# Altium project SB0040B.PrjPCB
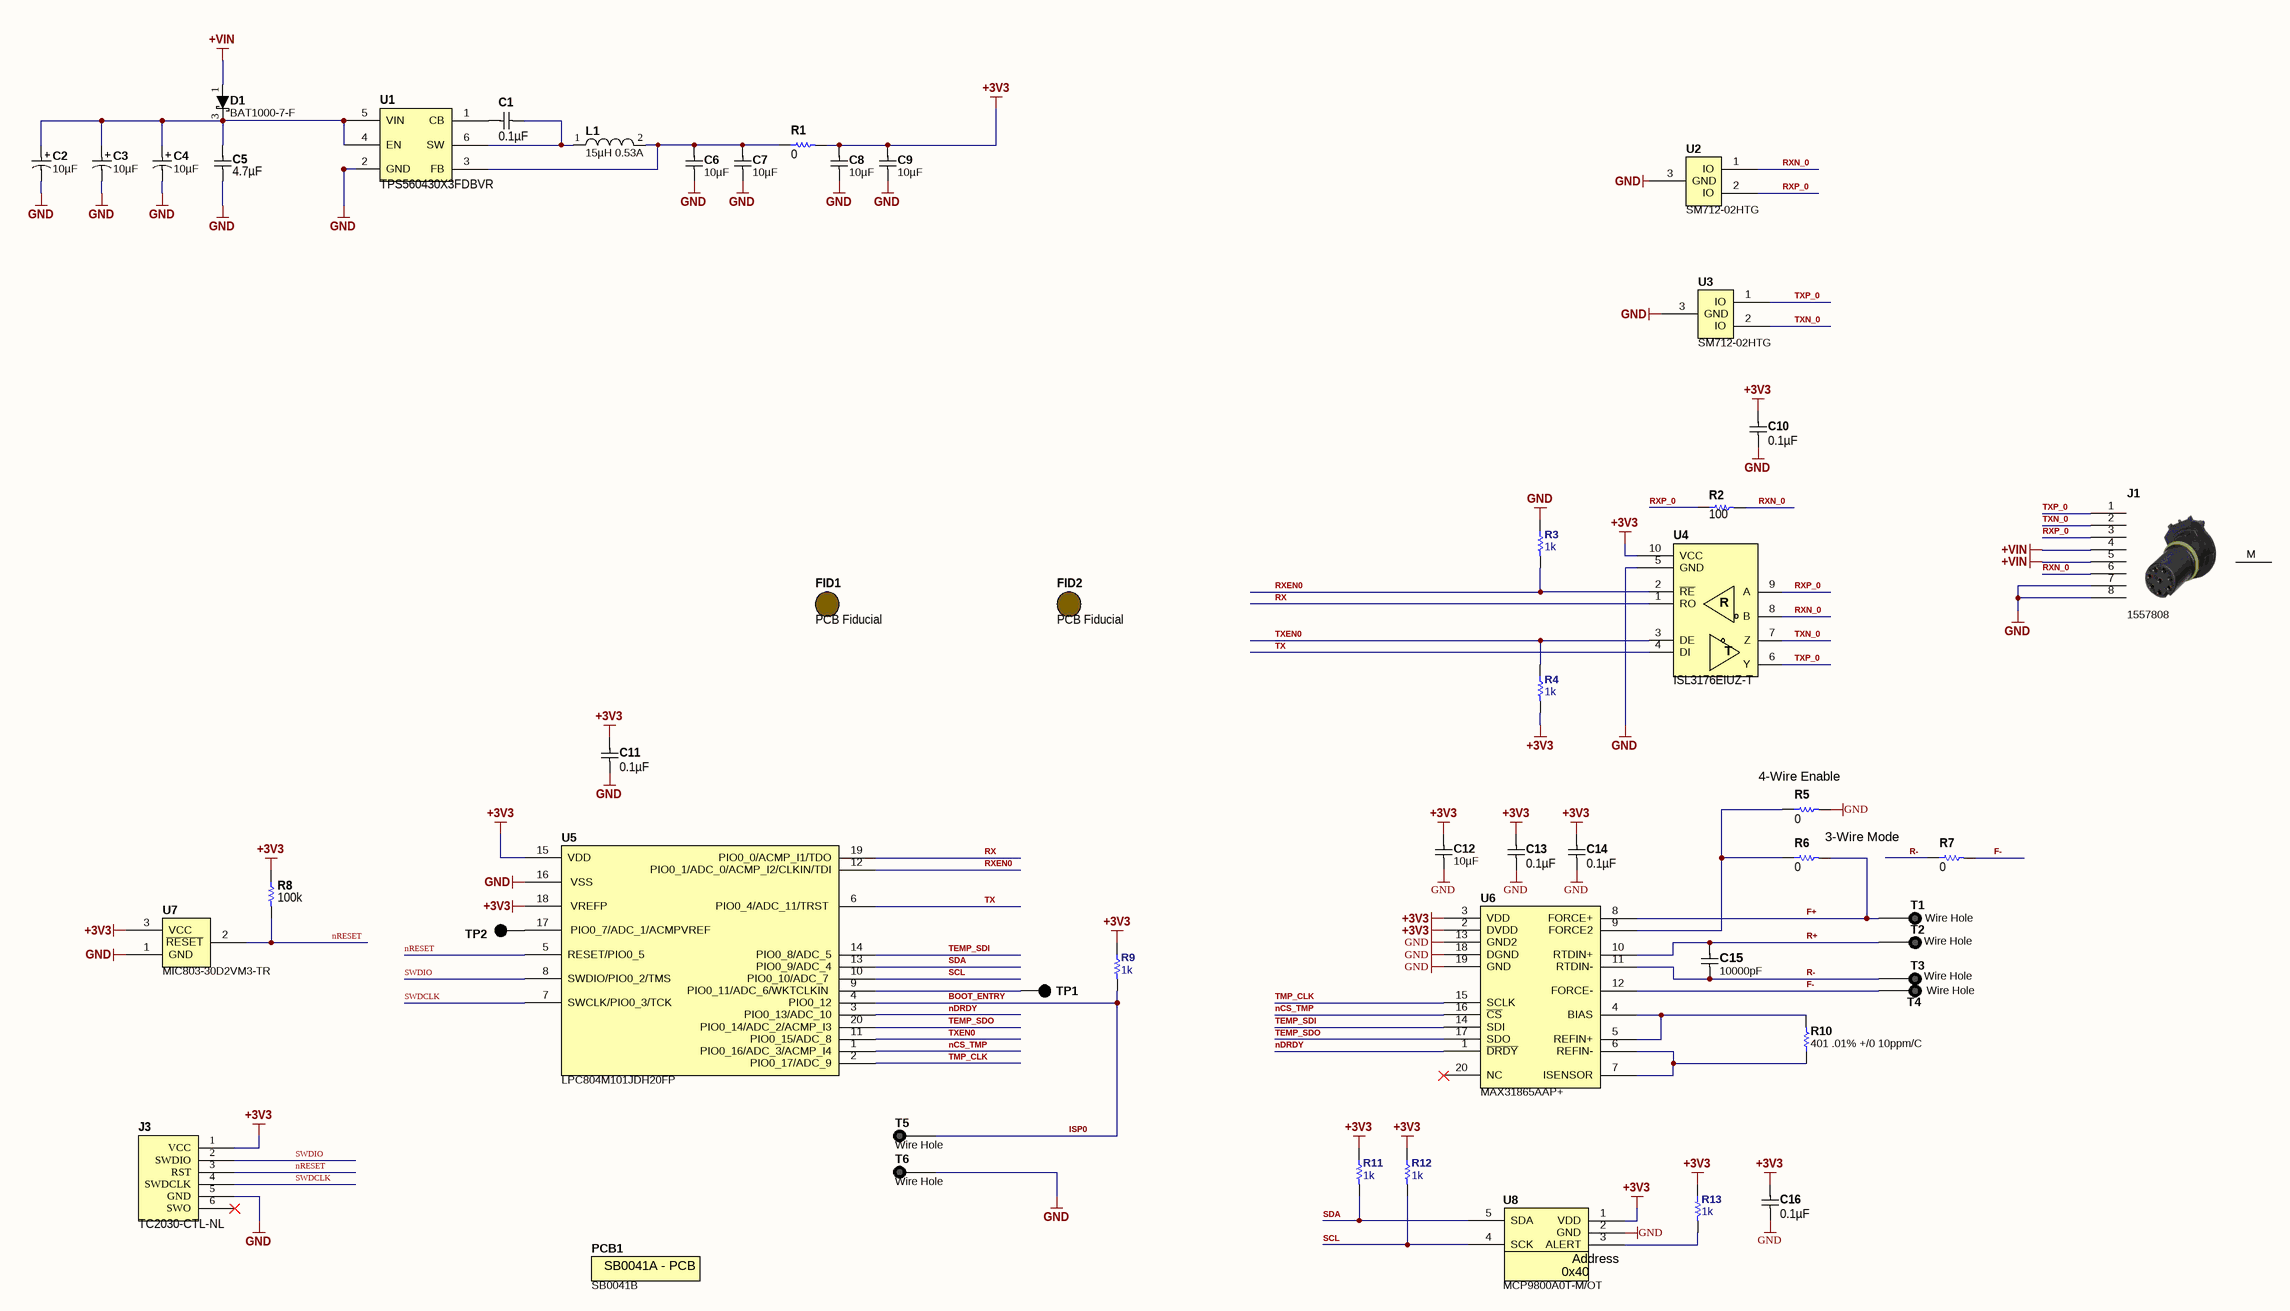
[diagram p0: TOP_LEVEL.SCHDOC]
BOM_NOTES_LINE_1: -; BOM_NOTES_LINE_2: -; BOM_NOTES_LINE_3: -; BOM_NOTES_LINE_4: -; CCA_PART_NUMBER: SB0040; CCA_TITLE: RTD to M12; PCB_COPPER_WEIGHT_INNER: N/A; PCB_COPPER_WEIGHT_OUTER: 1oz; PCB_FINISH_PLATING: GOLD ENIG; PCB_FINISHED_THICKNESS: .0625"; PCB_LAYERS: 4; PCB_MATERIAL: FR4; PCB_MIN_DRILL: 10; PCB_MIN_TRACE_SPACE: 6; PCB_MIN_TRACE_WIDTH: 6; PCB_PART_NUMBER: SB0041; PCB_PRINTOUT_SCALE: 1:1; PCB_SILKSCREEN_COLOR_BOTTOM: WHITE; PCB_SILKSCREEN_COLOR_TOP: WHITE; PCB_SOLDER_MASK_COLOR_BOTTOM: BLACK; PCB_SOLDER_MASK_COLOR_TOP: BLACK; PCB_TITLE: RTD to M12; PCB_VERSION: B; PROJECT_ENGINEER: E. Hughes; PROJECT_SHORT_TITLE: NRF_1CH_CELL; PROJECT_STATUS: PROTOTYPE; PROJECT_TITLE_LINE_1: RTD to M12; SCH_DATE: 2020-08-27
1 sheet, 52 parts. Net scope: hierarchical (ports join the sheet entries above them; power ports are global).
Board file: SB0041B.PCBDOC

## Sheet TOP_LEVEL.SCHDOC: FTDI 4-CH
size D; DocumentNumber: 1; SheetNumber: 4; SheetTotal: 4; PageSetup: Record=PageOptions|CenterHorizontal=True|CenterVertical=True|PrintScale=0.98|XCorrection=1.00|YCorrection=1.00|PrintKind=0|BorderSize=5000000|LeftOffset=0|BottomOffset=0|Orientation=2|PaperLength=1000|PaperWidth=1000|Scale=100|PaperSource=7|PrintQuality=600|MediaType=1|DitherType=10|PaperKind=Letter|PrintScaleMode=1; PAGE_TITLE: TOP LEVEL

### Parts
C1  0.1µF  [C0603_0.90MM_MD]
C2  10µF  [C_ALU_B]
C3  10µF  [C_ALU_B]
C4  10µF  [C_ALU_B]
C5  4.7µF  [C0805_1.50MM_MD]
C6  10µF  [C0805_1.25MM_MD]
C7  10µF  [C0805_1.25MM_MD]
C8  10µF  [C0805_1.25MM_MD]
C9  10µF  [C0805_1.25MM_MD]
C10  0.1µF  [C0603_0.90MM_MD]
C11  0.1µF  [C0603_0.90MM_MD]
C12  10µF  [C0805_1.25MM_MD]
C13  0.1µF  [C0603_0.90MM_MD]
C14  0.1µF  [C0603_0.90MM_MD]
C15  10000pF  [C0603_0.90MM_HD]
C16  0.1µF  [C0603_0.90MM_MD]
D1  BAT1000-7-F  [D_SOT-23-3_P]
FID1  PCB Fiducial  [Fiducial 1mm - 2mm]  (no BOM)
FID2  PCB Fiducial  [Fiducial 1mm - 2mm]  (no BOM)
J1  1557808  [1557808]
J3  TC2030‐CTL‐NL  [TC2030]  (no BOM)
L1  15µH 0.53A  [L_NRH3012]
PCB1  SB0041B  (mechanical)
R1  0  [R0603_0.55MM_MD]
R2  100  [R0603_0.55MM_MD]
R3  1k  [R0603_0.55MM_MD]
R4  1k  [R0603_0.55MM_MD]
R5  0  [R0603_0.55MM_MD]
R6  0  [R0603_0.55MM_MD]
R7  0  [R0603_0.55MM_MD]
R8  100k  [R0603_0.55MM_MD]
R9  1k  [R0603_0.55MM_MD]
R10  401 .01% +/0 10ppm/C  [R0603_0.55MM_MD]
R11  1k  [R0603_0.55MM_MD]
R12  1k  [R0603_0.55MM_MD]
R13  1k  [R0603_0.55MM_MD]
T1  Wire Hole  [SOLDER_HOLE]  (no BOM)
T2  Wire Hole  [SOLDER_HOLE]  (no BOM)
T3  Wire Hole  [SOLDER_HOLE]  (no BOM)
T4  Wire Hole  [SOLDER_HOLE]  (no BOM)
T5  Wire Hole  [SOLDER_HOLE]  (no BOM)
T6  Wire Hole  [SOLDER_HOLE]  (no BOM)
TP1  SMT_TEST  [SMT_TP - 35]  (value not drawn)  (no BOM)
TP2  SMT_TEST  [SMT_TP - 35]  (value not drawn)  (no BOM)
U1  TPS560430X3FDBVR  [SOT95P245X145-6L]
U2  SM712-02HTG  [SOT-23]
U3  SM712-02HTG  [SOT-23]
U4  ISL3176EIUZ-T  [10 MSOP]
U5  LPC804M101JDH20FP  [TSOP65P640X105-20N]
U6  MAX31865AAP+  [SOP65P780X200-20N]
U7  MIC803-30D2VM3-TR  [SOT-23]
U8  MCP9800A0T-M/OT  [SOT23-5]

### Nets
+3V3: C8.2 C9.2 C10.2 C11.2 C12.2 C13.2 C14.2 C16.2 J3.1(VCC) R1.2 R4.2 R8.1 R9.1 R11.1 R12.1 R13.1 U4.10(VCC) U5.15(VDD) U5.18(VREFP) U6.2(DVDD) U6.3(VDD) U7.3(VCC) U8.1(VDD)
+VIN: D1.1(A) J1.4 J1.5
GND: C2.2 C3.2 C4.2 C5.1 C6.1 C7.1 C8.1 C9.1 C10.1 C11.1 C12.1 C13.1 C14.1 C16.1 J1.7 J1.8 J3.5(GND) R3.1 R5.2 T6.1 U1.2(GND) U3.3(GND) U4.5(GND) U5.16(VSS) U6.13(GND2) U6.18(DGND) U6.19(GND) U7.1(GND) U8.2(GND)
BOOT_ENTRY: R9.2 T5.1 U5.4(PIO0_12)  [also labelled ISP0]
F+: R6.2 T1.1 U6.8(FORCE+)
F-: R7.2 T4.1 U6.12(FORCE-)
nCS_TMP: U5.1(PIO0_16/ADC_3/ACMP_I4) U6.16(~{CS})
nDRDY: U5.3(PIO0_13/ADC_10) U6.1(~{DRDY})
nRESET: J3.3(RST) R8.2 U5.5(RESET/PIO0_5) U7.2(~{RESET})
R+: C15.2 T2.1 U6.10(RTDIN+)
R-: C15.1 R7.1 T3.1 U6.11(RTDIN-)
RX: U4.1(RO) U5.19(PIO0_0/ACMP_I1/TDO)
RXEN0: R3.2 U4.2(~{RE}) U5.12(PIO0_1/ADC_0/ACMP_I2/CLKIN/TDI)
RXN_0: J1.6 R2.2 U2.1(IO) U4.8(B)
RXP_0: J1.3 R2.1 U2.2(IO) U4.9(A)
SCL: R12.2 U5.10(PIO0_10/ADC_7) U8.4(SCK)
SDA: R11.2 U5.13(PIO0_9/ADC_4) U8.5(SDA)
SWDCLK: J3.4(SWDCLK) U5.7(SWCLK/PIO0_3/TCK)
SWDIO: J3.2(SWDIO) U5.8(SWDIO/PIO0_2/TMS)
TEMP_SDI: U5.14(PIO0_8/ADC_5) U6.14(SDI)
TEMP_SDO: U5.20(PIO0_14/ADC_2/ACMP_I3) U6.17(SDO)
TMP_CLK: U5.2(PIO0_17/ADC_9) U6.15(SCLK)
TX: U4.4(DI) U5.6(PIO0_4/ADC_11/TRST)
TXEN0: R4.1 U4.3(DE) U5.11(PIO0_15/ADC_8)
TXN_0: J1.2 U3.2(IO) U4.7(Z)
TXP_0: J1.1 U3.1(IO) U4.6(Y)
NetC1_1: C1.1 L1.1 U1.6(SW)
NetC1_2: C1.2 U1.1(CB)
NetC2_1: C2.1 C3.1 C4.1 C5.2 D1.3(K) U1.4(EN) U1.5(VIN)
NetC6_2: C6.2 C7.2 L1.2 R1.1 U1.3(FB)
NetR5_1: R5.1 R6.1 U6.9(FORCE2)
NetR10_1: R10.1 U6.6(REFIN-) U6.7(ISENSOR)
NetR10_2: R10.2 U6.4(BIAS) U6.5(REFIN+)
NetR13_2: R13.2 U8.3(ALERT)
NetTP1_1: TP1.1 U5.9(PIO0_11/ADC_6/WKTCLKIN)
NetTP2_1: TP2.1 U5.17(PIO0_7/ADC_1/ACMPVREF)

Not connected (* = marked no-connect by the designer): J1 M; J3 6(SWO)*; U2 3(GND); U6 20(NC)*

### Notes on the sheet
- (near R5) 4-Wire Enable
- 3-Wire Mode
- Labels drawn without touching a wire or pin: GND
- PCB REV
- CCA REV
- Sheet
- of
- (in symbol ISL3176EIUZ-T) R; T
- (in symbol MCP9800A0T-M/OT) Address; 0x40
- (in symbol SB0041B) SB0041A - PCB

### Library data of the parts
C1 C10 C11 C13 C14 C16 = CGA3E2X7R1H104K080AE: CAP CER 0.1UF 50V X7R 0603; Manufacturer: TDK Corporation; Tolerance: ±10%; Substitution Notes: 0.1µF , 50V , ±10% , X7R , -55°C ~ 125°C , AEC-Q200 , 0603; Value: 0.1µF; Temperature Coefficient: X7R; Manufacturer Part Number: CGA3E2X7R1H104K080AE; ComponentLink1Description: Datasheet (Internal); ComponentLink1URL: datasheets\TDK\mlcc_automotive_general_en.pdf; ComponentLink2Description: Datasheet (External); ComponentLink2URL: https://product.tdk.com/info/en/catalog/datasheets/mlcc_automotive_general_en.pdf; Supplier 1: Digikey; Supplier Part Number 1: 445-15957-1-ND; Category: Capacitors; Voltage - Rated: 50V; Features: Soft Termination; Operating Temperature: -55°C ~ 125°C; Ratings: AEC-Q200; Package: 0603; Thickness (Max): 0.90MM
C2-C4 = EEE-FK1V100UR: CAP ALUM 10UF 35V 20% SMD; Manufacturer: Panasonic Electronic Components; Lifetime @ Temp#: 2000 Hrs @ 105°C; Ripple Current: 90mA; Impedance: 1.35 Ohm; Surface Mount Land Size: 0.169" L x 0.169" W (4.30mm x 4.30mm); Value_Voltage: 10µF  35V; Value: 10µF; Temperature Coefficient: Temperature Coefficient; Manufacturer Part Number: EEE-FK1V100UR; ComponentLink1Description: Internal Datasheet; ComponentLink1URL: http://industrial.panasonic.com/www-cgi/jvcr13pz.cgi?E+PZ+3+ABA0120+EEEFK1V100UR+7+WW; ComponentLink2Description: External Datasheet; ComponentLink2URL: http://industrial.panasonic.com/www-cgi/jvcr13pz.cgi?E+PZ+3+ABA0120+EEEFK1V100UR+7+WW; Supplier 1: Digi-Key; Supplier Part Number 1: PCE3834CT-ND; Category: Capacitors; Sort Value: 10000000; Sort Value Package: B_10000000; Capacitance: 10µF; Voltage Rating: 35V; Tolerance: ±20%; Operating Temperature: -55°C ~ 105°C; Features: General Purpose; ESR (Equivalent Series Resistance): -; Mounting Type: Surface Mount; Package / Case: Radial- Can - SMD; Size / Dimension: 0.157" Dia (4.00mm); Height - Seated (Max): 0.228" (5.80mm); Lead Spacing: -; Packaging: Cut Tape (CT); Diameter: 4.00; Height: 5.80; Package: B; Ratings: AEC-Q200
C5 = CGA4J1X7R1V475K125AE: CAP CER 4.7UF 35V X7R 0805; Manufacturer: TDK Corporation; Tolerance: ±10%; Substitution Notes: 4.7µF , 35V , ±10% , X7R , -55°C ~ 125°C , AEC-Q200 , 0805; Value: 4.7µF; Temperature Coefficient: X7R; Manufacturer Part Number: CGA4J1X7R1V475K125AE; ComponentLink1Description: Datasheet (Internal); ComponentLink1URL: datasheets\TDK\mlcc_automotive_general_en.pdf; ComponentLink2Description: Datasheet (External); ComponentLink2URL: https://product.tdk.com/info/en/catalog/datasheets/mlcc_automotive_general_en.pdf; Supplier 1: Digikey; Supplier Part Number 1: 445-172479-1-ND; Category: Capacitors; Voltage - Rated: 35V; Features: Soft Termination; Operating Temperature: -55°C ~ 125°C; Ratings: AEC-Q200; Package: 0805; Thickness (Max): 1.50MM
C6-C9 C12 = CGA4J1X7R0J106K125AD: CAP CER 10UF 6.3V X7R 0805; Manufacturer: TDK Corporation; Tolerance: ±10%; Substitution Notes: 10µF , 6.3V , ±10% , X7R , -55°C ~ 125°C , AEC-Q200 , 0805; Value: 10µF; Temperature Coefficient: X7R; Manufacturer Part Number: CGA4J1X7R0J106K125AD; ComponentLink1Description: Datasheet (Internal); ComponentLink1URL: datasheets\TDK\mlcc_automotive_general_en.pdf; ComponentLink2Description: Datasheet (External); ComponentLink2URL: https://product.tdk.com/info/en/catalog/datasheets/mlcc_automotive_general_en.pdf; Supplier 1: Digikey; Supplier Part Number 1: 445-9935-1-ND; Category: Capacitors; Voltage - Rated: 6.3V; Features: Epoxy Mountable; Operating Temperature: -55°C ~ 125°C; Ratings: AEC-Q200; Package: 0805; Thickness (Max): 1.25MM
C15 = AC0603KPX7R9BB103: CAP CER 10000PF 50V X7R 0603; Manufacturer: Yageo; Tolerance: ±10%; Substitution Notes: 10000pF , 50V , ±10% , X7R , -55°C ~ 125°C , AEC-Q200 , 0603; Value: 10000pF; Temperature Coefficient: X7R; Manufacturer Part Number: AC0603KPX7R9BB103; ComponentLink1Description: Datasheet (Internal); ComponentLink1URL: datasheets\Yageo\yageo_ac.pdf; ComponentLink2Description: Datasheet (External); ComponentLink2URL: http://www.yageo.com/NewPortal/yageodocoutput?fileName=/pdf/MLCC/UPY-AC_NP0X7R_16V-to-630V_9.pdf; Supplier 1: Digikey; Supplier Part Number 1: 311-3284-1-ND; Category: Capacitors; Voltage - Rated: 50V; Operating Temperature: -55°C ~ 125°C; Ratings: AEC-Q200; Package: 0603; Thickness (Max): 0.90MM
D1 = BAT1000-7-F: DIODE SCHOTTKY 40V 1A SOT23; Manufacturer: Diodes Inc; CategorySort: 400; Voltage - Forward (Vf) (Max) @ If: 500mV @ 1A; Speed: Fast Recovery =< 500ns- > 200mA (Io); Current - Reverse Leakage @ Vr: 100µA @ 30V; Capacitance @ Vr- F: 175pF @ 0V- 1MHz; Num Pins: 3; Diode Suffix: 1A_3C; Category: Diodes; Value: BAT1000-7-F; Manufacturer Part Number: BAT1000-7-F; ComponentLink1Description: Internal Datasheet; ComponentLink1URL: http://www.diodes.com/datasheets/ds30245.pdf; ComponentLink2Description: External Datasheet; ComponentLink2URL: http://www.diodes.com/datasheets/ds30245.pdf; Supplier 1: Digi-Key; Supplier Part Number 1: BAT1000-7FDICT-ND; SortValue: BAT1000-7-F; Diode Type: Schottky; Voltage - DC Reverse (Vr) (Max): 40V; Current - Average Rectified (Io): 1A; Reverse Recovery Time (trr): -; Mounting Type: Surface Mount; Package: TO-236-3- SC-59- SOT-23-3; Supplier Device Package: SOT-23-3; Packaging: Cut Tape (CT)
FID1 FID2 = Fiducial: Value: PCB Fiducial
J1 = 1557808: Circular Metric Connectors SACC-CI-M12FS -8CON-L180-THR; Manufacturer: Phoenix Contact; Current Rating: 2A; Voltage Rating: 30V; Number of Positions: 8; Connector Type: Receptacle; Number of Ports: 1; Gender: Female; Strain Relief: No (Without); Thread Size: M12; Ratings: IP67,Waterproof,Dust Tight; Value: 1557808; Supplier 1: Digi-Key; Supplier Part Number 1: 1557808-ND; Manufacturer Part Number: 1557808; RoHS: Yes; Category: Circular Connectors; Mount: Through Hole; Weight: 0.134041oz; Contact Plating: Gold; Contact Material: Brass; Number of Terminals: 8; Min Operating Temperature: -25°C; Max Operating Temperature: 85°C; Packaging: Tray; Package Quantity: 60; Termination: Solder; Orientation: Straight; Fastening Type: Threaded; Contact Gender: Female; Max Current Rating: 2A; Number of Contacts: 8; ComponentLink1URL: https://datasheet.ciiva.com/618/1557808-618998.pdf?src-supplier=Digi-Key; ComponentLink1Description: https://datasheet.ciiva.com/618/1557808-618998.pdf?src-supplier=Digi-Key; ComponentLink2URL: https://datasheet.ciiva.com/3962/1557808-3962478.pdf?src-supplier=Arrow; ComponentLink2Description: https://datasheet.ciiva.com/3962/1557808-3962478.pdf?src-supplier=Arrow; ComponentLink3URL: https://datasheet.ciiva.com/29259/719945-da-01-en-sens-akt-einbaubuch-8pol-1557808-60-st-29259366.pdf?src-supplier=Conrad; ComponentLink3Description: https://datasheet.ciiva.com/29259/719945-da-01-en-sens-akt-einbaubuch-8pol-1557808-60-st-29259366.pdf?src-supplier=Conrad
J3 = TC2030‐CTL‐NL: Tag Connect Pads - No latching Clips - ARM; Value: TC2030‐CTL‐NL
L1 = NRH3012T150MN: Inductor 15µH 0.53A; Manufacturer: Taiyo Yuden; CategorySort: 300; Inductance (uH): 15; Tolerance: ±20%; DCR Max (Ohms): 540 mOhm Max; SRF typ (MHz): 26MHz; Isat (A): 0.53; IRMS: 0.57; Shielding: Sheilded; Category: Inductors; Value: 15µH 0.53A; Manufacturer Part Number: NRH3012T150MN; ComponentLink1Description: External Datasheet; ComponentLink1URL: https://www.yuden.co.jp/productdata/catalog/en/wound04_e.pdf; Sort Value: 15_0.53; Sort Value Package: 15_0.53_NRH3012; Part Number: NRH3012T150MN; Supplier 1: Digikey; Supplier Part Number 1: 587-2585-1-ND; Supplier Unit Price 1: 0.28; Package: NRH3012; Height (mm): 1.2MM; Rating: -
PCB1 = SB0041B: SB0041 PCB Revision B; Manufacturer: TZero; Value: SB0041B; Manufacturer Part Number: SB0041B
R1 R5-R7 = ERJ-3GEY0R00V: RES 0.0 OHM 1/10W JUMP 0603 SMD; Manufacturer: Panasonic Electronic Components; Package Power: 0603  (0.1W); Power (Watts): 0.1W- 1/10W; Tolerance: Jumper; Limiting Element Voltage: 75; Maximum Overload Voltage: 150; Maximum Working Voltage: 0.0V; Substitution Notes: 0 , Jumper , 0603 , AEC-Q200; Value: 0; Manufacturer Part Number: ERJ-3GEY0R00V; ComponentLink1Description: Internal Datasheet; ComponentLink1URL: datasheets\Panasonic Electronic Components\AOA0000CE1.pdf; ComponentLink2Description: External Datasheet; ComponentLink2URL: http://industrial.panasonic.com/www-data/pdf/AOA0000/AOA0000CE1.pdf; Supplier 1: Digi-Key; Supplier Part Number 1: P0.0GCT-ND; Category: Resistors; Resistance (Ohms): 0; Composition: Thick Film; Features: -; Temperature Coefficient: -; Package: 0603 (1608 Metric); Supplier Package: 0603; Size / Dimension: 0.063" L x 0.031" W (1.60mm x 0.80mm); Height: 0.55MM; Number of Terminations: 2; Sort Value: 0; Sort Value Package: 603_0; Ratings: AEC-Q200
R2 = ERJ-3EKF1000V: RES 100 OHM 1/10W 1% 0603 SMD; Manufacturer: Panasonic Electronic Components; Package Power: 0603  (0.1W); Power (Watts): 0.1W- 1/10W; Temperature Coefficient: ±100ppm/°C; Limiting Element Voltage: 75; Maximum Overload Voltage: 150; Maximum Working Voltage: 3.2V; Substitution Notes: 100 , ±1% , 0603 , AEC-Q200; Value: 100; Manufacturer Part Number: ERJ-3EKF1000V; ComponentLink1Description: Internal Datasheet; ComponentLink1URL: datasheets\Panasonic Electronic Components\AOA0000CE2.pdf; ComponentLink2Description: External Datasheet; ComponentLink2URL: http://industrial.panasonic.com/www-data/pdf/AOA0000/AOA0000CE2.pdf; Supplier 1: Digi-Key; Supplier Part Number 1: P100HCT-ND; Category: Resistors; Resistance (Ohms): 100; Composition: Thick Film; Features: -; Tolerance: ±1%; Package: 0603 (1608 Metric); Supplier Package: 0603; Size / Dimension: 0.063" L x 0.031" W (1.60mm x 0.80mm); Height: 0.55MM; Number of Terminations: 2; Packaging: Cut Tape (CT); Sort Value: 100; Sort Value Package: 603_100; Ratings: AEC-Q200
R3 R4 R9 R11-R13 = ERJ-3EKF1001V: RES 1K OHM 1/10W 1% 0603 SMD; Manufacturer: Panasonic Electronic Components; Package Power: 0603  (0.1W); Power (Watts): 0.1W- 1/10W; Temperature Coefficient: ±100ppm/°C; Limiting Element Voltage: 75; Maximum Overload Voltage: 150; Maximum Working Voltage: 10.0V; Substitution Notes: 1k , ±1% , 0603 , AEC-Q200; Value: 1k; Manufacturer Part Number: ERJ-3EKF1001V; ComponentLink1Description: Internal Datasheet; ComponentLink1URL: datasheets\Panasonic Electronic Components\AOA0000CE2.pdf; ComponentLink2Description: External Datasheet; ComponentLink2URL: http://industrial.panasonic.com/www-data/pdf/AOA0000/AOA0000CE2.pdf; Supplier 1: Digi-Key; Supplier Part Number 1: P1.00KHCT-ND; Category: Resistors; Resistance (Ohms): 1k; Composition: Thick Film; Features: -; Tolerance: ±1%; Package: 0603 (1608 Metric); Supplier Package: 0603; Size / Dimension: 0.063" L x 0.031" W (1.60mm x 0.80mm); Height: 0.55MM; Number of Terminations: 2; Packaging: Cut Tape (CT); Sort Value: 1000; Sort Value Package: 603_1000; Ratings: AEC-Q200
R8 = ERJ-3EKF1003V: RES 100K OHM 1/10W 1% 0603 SMD; Manufacturer: Panasonic Electronic Components; Package Power: 0603  (0.1W); Power (Watts): 0.1W- 1/10W; Temperature Coefficient: ±100ppm/°C; Limiting Element Voltage: 75; Maximum Overload Voltage: 150; Maximum Working Voltage: 75.0V; Substitution Notes: 100k , ±1% , 0603 , AEC-Q200; Value: 100k; Manufacturer Part Number: ERJ-3EKF1003V; ComponentLink1Description: Internal Datasheet; ComponentLink1URL: datasheets\Panasonic Electronic Components\AOA0000CE2.pdf; ComponentLink2Description: External Datasheet; ComponentLink2URL: http://industrial.panasonic.com/www-data/pdf/AOA0000/AOA0000CE2.pdf; Supplier 1: Digi-Key; Supplier Part Number 1: P100KHCT-ND; Category: Resistors; Resistance (Ohms): 100k; Composition: Thick Film; Features: -; Tolerance: ±1%; Package: 0603 (1608 Metric); Supplier Package: 0603; Size / Dimension: 0.063" L x 0.031" W (1.60mm x 0.80mm); Height: 0.55MM; Number of Terminations: 2; Packaging: Cut Tape (CT); Sort Value: 100000; Sort Value Package: 603_100000; Ratings: AEC-Q200
R10 = RQ73C1J402RBTD: 402 ±0.1% 0.15W Chip Resistor 0603 (1608 Metric) Anti-Sulfur, Automotive AEC-Q200 Thin Film; Manufacturer: TE Connectivity; Supplier 1: Digi-Key; Supplier Part Number 1: A140868CT-ND; Manufacturer Part Number: RQ73C1J402RBTD; RoHS: No; Category: Chip SMD Resistors; Stock: 7920; Pricing: 1=0.73000, 10=0.60900, 100=0.40910, 1000=0.23936, 2500=0.23675 (USD); Value: 401 .01% +/0 10ppm/C
T1-T6 = SOLDER_HOLE
U1 = TPS560430X3FDBVR: Buck Switching Regulator IC Positive PWM 3.3V 1 Output 600mA SOT-23-6; Manufacturer: Texas Instruments; Supplier 1: Digi-Key; Manufacturer Part Number: TPS560430X3FDBVR; Stock 1: 3365; Pricing 1: 1 = 2.01000, 10 = 1.80100, 100 = 1.44800, 500 = 1.18966, 1000 = 0.98571 (USD); Supplier Part Number 1: 296-51994-1-ND; Value: TPS560430X3FDBVR
U2 U3 = SM712-02HTG: LITTELFUSE - SM712-02HTG - ESD Protection Device, 31 V, SOT-23, 3 Pins, 12 V, 600 W, SPA SM712 Series; Number of Bidirectional Channels: 2; Reverse Standoff Voltage: 12V; Min Breakdown Voltage: 13.3V; Clamping Voltage: 31V; Peak Pulse Power: 600W; Power Line Protection: No; Direction: Bidirectional; Leakage Current: 20uA; Capacitance: 75pF; Element Configuration: Dual; Max Surge Current: 19A; Value: SM712-02HTG; Supplier 1: Digi-Key; Supplier Part Number 1: F6450DKR-ND; Manufacturer: Littelfuse; Manufacturer Part Number: SM712-02HTG; RoHS: Yes; Category: TVS Diodes; Stock: 93132; Pricing: 1=0.75000, 10=0.62000, 100=0.48000, 500=0.36000, 1000=0.27600 (USD); Mount: Surface Mount; Case/Package: SOT-23-3; Number of Pins: 3; Min Operating Temperature: -40°C; Max Operating Temperature: 125°C; Packaging: Tape and Reel; Working Voltage: 12V; Polarity: Bidirectional; Termination: SMD/SMT; Number of Channels: 2; Breakdown Voltage: 13.3V; Max Power Dissipation: 600W; Package Quantity: 3000; Peak Pulse Current: 19A; Composition: Zener; Length: 3.04mm; Depth: 1.4mm; Radiation Hardening: No; Lead Free: Lead Free; ComponentLink1URL: http://www.farnell.com/datasheets/2915217.pdf?src-supplier=Farnell; ComponentLink1Description: http://www.farnell.com/datasheets/2915217.pdf?src-supplier=Farnell; ComponentLink2URL: http://www.mouser.com/ds/2/240/Littelfuse_TVS_Diode_Array_SM712_Datasheet.pdf-345740.pdf?src-supplier=Mouser; ComponentLink2Description: http://www.mouser.com/ds/2/240/Littelfuse_TVS_Diode_Array_SM712_Datasheet.pdf-345740.pdf?src-supplier=Mouser; ComponentLink3URL: http://components.arrow.com/part/dataview/66888491S1073949N9157?src-supplier=Arrow+Electronics; ComponentLink3Description: http://components.arrow.com/part/dataview/66888491S1073949N9157?src-supplier=Arrow+Electronics; ComponentLink4URL: http://www.farnell.com/datasheets/1853511.pdf?src-supplier=Newark; ComponentLink4Description: http://www.farnell.com/datasheets/1853511.pdf?src-supplier=Newark; ComponentLink5URL: https://www.littelfuse.com/~/media/electronics/datasheets/tvs_diode_arrays/littelfuse_tvs_diode_array_sm712_datasheet.pdf.pdf?src-supplier=Digi-Key; ComponentLink5Description: https://www.littelfuse.com/~/media/electronics/datasheets/tvs_diode_arrays/littelfuse_tvs_diode_array_sm712_datasheet.pdf.pdf?src-supplier=Digi-Key; ComponentLink6URL: http://www.farnell.com/datasheets/2277128.pdf?src-supplier=Newark; ComponentLink6Description: http://www.farnell.com/datasheets/2277128.pdf?src-supplier=Newark; ComponentLink7URL: http://www.farnell.com/datasheets/2915217.pdf?src-supplier=Element14; ComponentLink7Description: http://www.farnell.com/datasheets/2915217.pdf?src-supplier=Element14
U4 = ISL3176EIUZ-T: IC TXRX RS422/485 20MBPS 10MSOP; Manufacturer: Intersil; Protocol: RS422, RS485; Number of Drivers/Receivers: 1/1; Duplex: Full; Voltage - Supply: 3 V ~ 3.6 V; Value: ISL3176EIUZ-T; Supplier 1: Digi-Key; Supplier Part Number 1: ISL3176EIUZ-TCT-ND; Manufacturer Part Number: ISL3176EIUZ-T; RoHS: RoHS Compliant; Category: Integrated Circuits (ICs); Stock 1: 9164; Pricing 1: 1=1.79, 10=1.61, 100=1.2944, 500=1.06348, 1000=0.88117 (USD); Packaging: Cut Tape (CT); Part Status: Active; Type: Transceiver; Data Rate: 20Mbps; Operating Temperature: -40°C ~ 85°C; Mounting Type: Surface Mount; Package / Case: 10-TFSOP, 10-MSOP (0.118", 3.00mm Width); Supplier Device Package: 10-MSOP; ComponentLink1URL: http://www.intersil.com/content/dam/intersil/documents/isl3/isl3170e-71e-72e-73e-74e-75e-76e-77e-78e.pdf; ComponentLink1Description: http://www.intersil.com/content/dam/intersil/documents/isl3/isl3170e-71e-72e-73e-74e-75e-76e-77e-78e.pdf
U5 = LPC804M101JDH20FP: MCU 32-bit ARM Cortex M0+ RISC 32KB Flash 3.3V 20-Pin TSSOP Tube; Manufacturer: NXP Semiconductors; Value: LPC804M101JDH20FP; Supplier 1: Digi-Key; Supplier Part Number 1: 568-13824-ND; Manufacturer Part Number: LPC804M101JDH20FP; RoHS: No; Category: Microcontrollers; Stock: 1734; Pricing: 1=1.56000, 10=1.39500, 25=1.32440, 100=1.08790, 250=1.01696, 500=0.89870, 1000=0.70950, 2500=0.66220, 5000=0.62909 (USD)
U6 = MAX31865AAP+: Temp Monitoring System (Sensor)  External Sensor SPI Output 20-SSOP; Manufacturer: Maxim; Value: MAX31865AAP+; Manufacturer Part Number: MAX31865AAP+; Supplier 1: Digi-Key; Supplier Part Number 1: MAX31865AAP+-ND; Stock 1: 622; Pricing 1: 1=3.47, 10=3.329 (USD); Mount: Surface Mount; Case/Package: SSOP; Min Operating Temperature: -40°C; Max Operating Temperature: 125°C; Packaging: Rail/Tube; Output Type: SPI; ComponentLink1URL: http://www.mouser.com/ds/2/256/MAX31865-775735.pdf; ComponentLink1Description: http://www.mouser.com/ds/2/256/MAX31865-775735.pdf; ComponentLink2URL: https://media.digikey.com/pdf/Data%20Sheets/Maxim%20PDFs/PartNumberBreakdown_ds.pdf; ComponentLink2Description: https://media.digikey.com/pdf/Data%20Sheets/Maxim%20PDFs/PartNumberBreakdown_ds.pdf; Supplier 2: Mouser; Supplier Part Number 2: 700-MAX31865AAP+; Stock 2: 9867; Pricing 2: 1=3.47, 10=3.33, 50=3.3, 100=3.3, 1000=3.3, 10000=3.3 (USD)
U7 = MIC803-30D2VM3-TR: 3-Pin Microprocessor Supervisor Circuit w/ Open-Drain Reset Output, 3 SOT-23 - T/R; Manufacturer: Microchip; Number of Voltages Monitored: 1; Reset: Active Low; Reset Timeout: 20ms; Threshold Voltage: 3V; Value: MIC803-30D2VM3-TR; Supplier 1: Digi-Key; Supplier Part Number 1: 576-3808-1-ND; Manufacturer Part Number: MIC803-30D2VM3-TR; Stock 1: 3642; Pricing 1: 1=0.3, 25=0.252, 100=0.231 (USD); Mount: Surface Mount; Case/Package: TO-236-3; Min Operating Temperature: -40°C; Max Operating Temperature: 125°C; Packaging: Cit Tape (CT); Type: Simple Reset/Power-On Reset; Lead Free: Lead Free
U8 = MCP9800A0T-M/OT: SENSOR TEMP I2C/SMBUS SOT23-5; Manufacturer: Microchip Technology; Sensor Type: Digital, Local; Sensing Temperature - Local: -55°C ~ 125°C; Output Type: I²C/SMBus; Voltage - Supply: 2.7 V ~ 5.5 V; Resolution: 11 b; Accuracy - Highest (Lowest): ±1°C (±3°C); Test Condition: -10°C ~ 85°C (-55°C ~ 125°C); Supplier 1: Digi-Key; Manufacturer Part Number: MCP9800A0T-M/OT; RoHS: RoHS Compliant; Category: Sensors, Transducers; Stock 1: 12000; Pricing 1: 3000=0.9373 (USD); Packaging: Tape & Reel (TR); Part Status: Active; Sensing Temperature - Remote: -; Features: One-Shot, Output Switch, Programmable Limit, Programmable Resolution, Shutdown Mode; Operating Temperature: -55°C ~ 125°C; Mounting Type: Surface Mount; Package / Case: SC-74A, SOT-753; Supplier Device Package: SOT-23-5; ComponentLink1URL: http://www.microchip.com/mymicrochip/filehandler.aspx?ddocname=en021183; ComponentLink1Description: http://www.microchip.com/mymicrochip/filehandler.aspx?ddocname=en021183; Value: MCP9800A0T-M/OT; Supplier Part Number 1: MCP9800A0T-M/OTCT-ND
TP1 TP2 = SMT_TEST: Value: SMT_TEST

## Assembly variants
B: not fitted R5